# Altium schematic sheet main_ver2.SchDoc
size A4
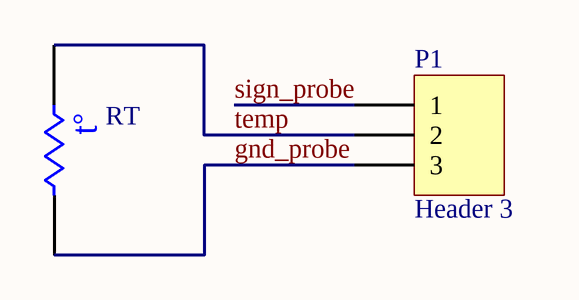
[diagram p0: main_ver2.SchDoc]

## Parts
P1  Header 3  [HDR1X3]
RT  Res Thermal  [6-0805_M]  (value not drawn)

## Nets
gnd_probe: P1.3 RT.2
sign_probe: P1.1
temp: P1.2 RT.1

## Notes on the sheet
- (in symbol Res Thermal) t°

## Library data of the parts
P1 = Header 3: Header, 3-Pin; LatestRevisionDate: 17-Jul-2002; LatestRevisionNote: Re-released for DXP Platform.; Publisher: Altium Limited
RT = Res Thermal: Thermistor; Published: 24-Mar-1999; LatestRevisionDate: 29-May-2009; LatestRevisionNote: IPC-7351 Footprint Added.; PackageVersion: Mar-2003; PackageReference: 6-0805; Publisher: Altium Limited; PackageDescription: Chip Resistor 0805 Case Size; Code_IPC: RESC2012